# Altium schematic sheet Input.SchDoc
size A4; SheetNumber: 2; SheetTotal: 4
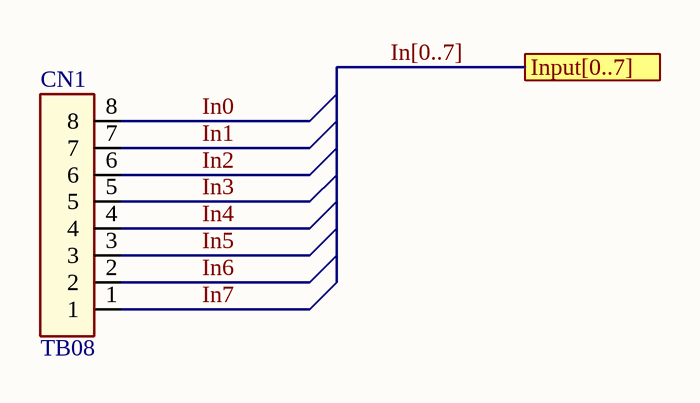
[diagram p0: Input.SchDoc]

## Parts
CN1  TB08  [TB508-08]

## Ports
Input[0..7]

## Nets
In0: CN1.8
In1: CN1.7
In2: CN1.6
In3: CN1.5
In4: CN1.4
In5: CN1.3
In6: CN1.2
In7: CN1.1

## Buses and harness runs
bus In[0..7] = port Input[0..7]

## Library data of the parts
CN1 = TB-08: Terminal Block; Manufacturer: *; Part number: *; Value: TB08; Unit price: *